# EAGLE design button_circle (EAGLE 7.1.0)
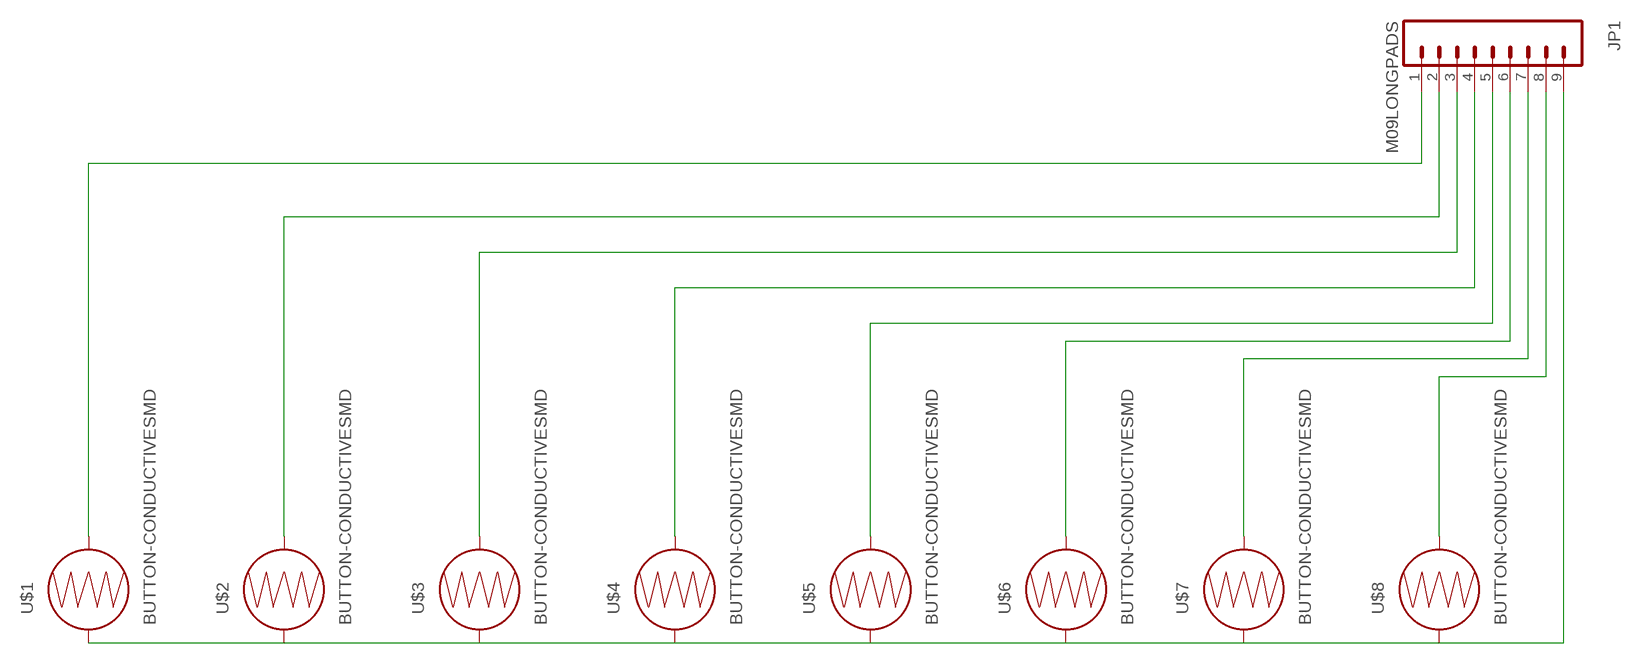
[diagram p0: schematic, sheet 1]

## Parts
JP1  M09LONGPADS  [1X09_LONGPADS]
U$1  BUTTON-CONDUCTIVESMD  [BUTTON-CONDUCTIVE]
U$2  BUTTON-CONDUCTIVESMD  [BUTTON-CONDUCTIVE]
U$3  BUTTON-CONDUCTIVESMD  [BUTTON-CONDUCTIVE]
U$4  BUTTON-CONDUCTIVESMD  [BUTTON-CONDUCTIVE]
U$5  BUTTON-CONDUCTIVESMD  [BUTTON-CONDUCTIVE]
U$6  BUTTON-CONDUCTIVESMD  [BUTTON-CONDUCTIVE]
U$7  BUTTON-CONDUCTIVESMD  [BUTTON-CONDUCTIVE]
U$8  BUTTON-CONDUCTIVESMD  [BUTTON-CONDUCTIVE]

## Nets
GND: JP1.9 U$1.1 U$2.1 U$3.1 U$4.1 U$5.1 U$7.1
N$2: JP1.8 U$8.2
N$3: JP1.7 U$7.2
N$4: JP1.6 U$6.2
N$5: JP1.5 U$5.2
N$6: JP1.4 U$4.2
N$7: JP1.3 U$3.2
N$8: JP1.2 U$2.2
N$9: JP1.1 U$1.2
Unconnected: U$6.1 U$8.1

## Library data of the parts
JP1 = Finn-lbr-rev1:M09: Header 9 Standard 9-pin 0.1" header. Use with straight break away headers (SKU : PRT-00116), right angle break away headers (PRT-00553), swiss pins (PRT-00743), machine pins (PRT-00117), and female headers (PRT-00115).
U$1-U$8 = Finn-lbr-rev1:BUTTON-CONDUCTIVE: Used with rubber key pads.

## Board
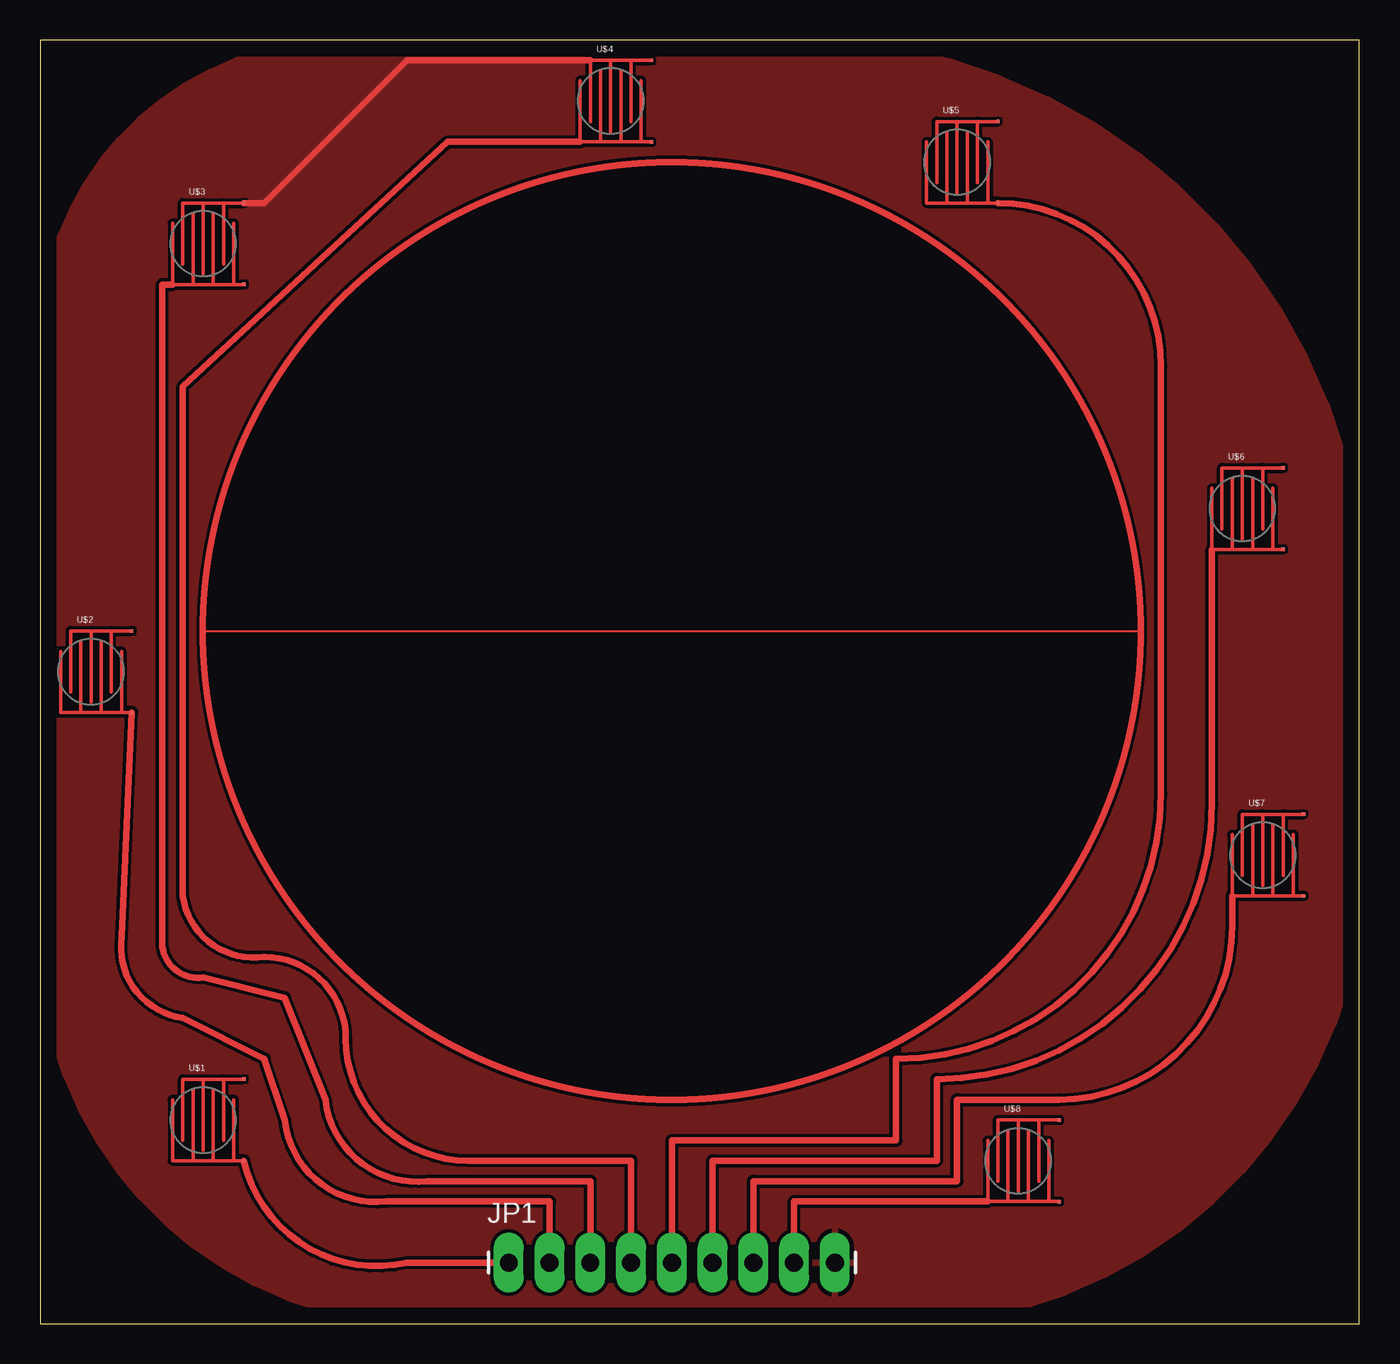
[diagram p1: board, top side]

Size 82.22 x 80 mm. Coordinates in mm from the lower left corner, seen from the top.
Outline: 0,0 82.22,0 82.22,80 0,80 0,0
Copper layers (1*16): Top 0.035mm / dielectric 1.5mm / Bottom 0.035mm
Design rules "default": minimum track width 10mil, minimum drill 24mil, track to track 8mil, track to pad 8mil, pad to pad 8mil, via to via 8mil, smd to smd 8mil, copper to edge 40mil, drill to drill 8mil, minimum pad ring 10mil, minimum via ring 8mil, stop-mask expansion 4mil, vias tented up to drill 0mil, thermal gap 10mil

### Footprints (pad centres in the part's own frame; a part is rotated, then mirrored left to right if it is on the bottom)
1X09_LONGPADS = drill 1.118 pad 1.88 long: 1 0,0; 2 2.54,0; 3 5.08,0; 4 7.62,0; 5 10.16,0; 6 12.7,0; 7 15.24,0; 8 17.78,0; 9 20.32,0
BUTTON-CONDUCTIVE = smd 0.203 x 0.203: 1 2.54,2.54; 2 2.54,-2.54

### Placement (x,y rotation side)
JP1  29.21,3.81 0 top
U$1  10.16,12.7 0 top
U$2  3.17,40.64 0 top
U$3  10.16,67.31 0 top
U$4  35.56,76.2 0 top
U$5  57.15,72.39 0 top
U$6  74.93,50.8 0 top
U$7  76.2,29.21 0 top
U$8  60.96,10.16 0 top

### Tracks (layer width: path | path; a pad name or v marks a point on that pad's centre or on a via)
GND
  Top 0.406: U$3.1 13.97,69.85 22.86,78.74 34.29,78.74
  pour Top: 0,40.64 0,60.96 arc-90 19.05,80.01 46.99,80.01 arc-90 82.55,44.45 82.55,29.21 arc-90 53.34,0 24.13,0 arc-90 0,24.13
N$2
  Top 0.406: JP1.8 46.99,7.62 59.05,7.62
N$3
  Top 0.406: JP1.7 44.45,8.89 57.15,8.89 57.15,13.97 63.5,13.97 arc90 74.3,24.77 74.3,26.67
N$4
  Top 0.406: JP1.6 41.91,10.16 55.88,10.16 55.88,15.24 arc90 73.03,32.38 73.03,48.26
N$5
  Top 0.406: JP1.5 39.37,11.43 53.34,11.43 53.34,16.51 arc90 69.85,33.02 69.85,59.69 arc90 U$5.2
N$6
  Top 0.406: JP1.4 36.83,10.16 26.67,10.16 arc-90 19.05,17.78 arc90 13.97,22.86 arc-90 8.89,26.67 8.89,58.42 25.4,73.66 33.66,73.66
N$7
  Top 0.406: JP1.3 34.29,8.89 24.13,8.89 arc-90 17.78,13.97 15.24,20.32 10.16,21.59 arc-90 7.62,23.5 7.62,64.77 8.26,64.77
N$8
  Top 0.406: JP1.2 31.75,7.62 21.59,7.62 arc-90 15.24,12.7 13.97,16.51 8.89,19.05 arc-90 5.08,24.13 U$2.2
N$9
  Top 0.406: JP1.1 22.86,3.81 arc-90 U$1.2
(copper drawn outside any net)
  shapes: Top area x1, Top circle x1